# EAGLE design SideSolarPanel (EAGLE 6.6.0)
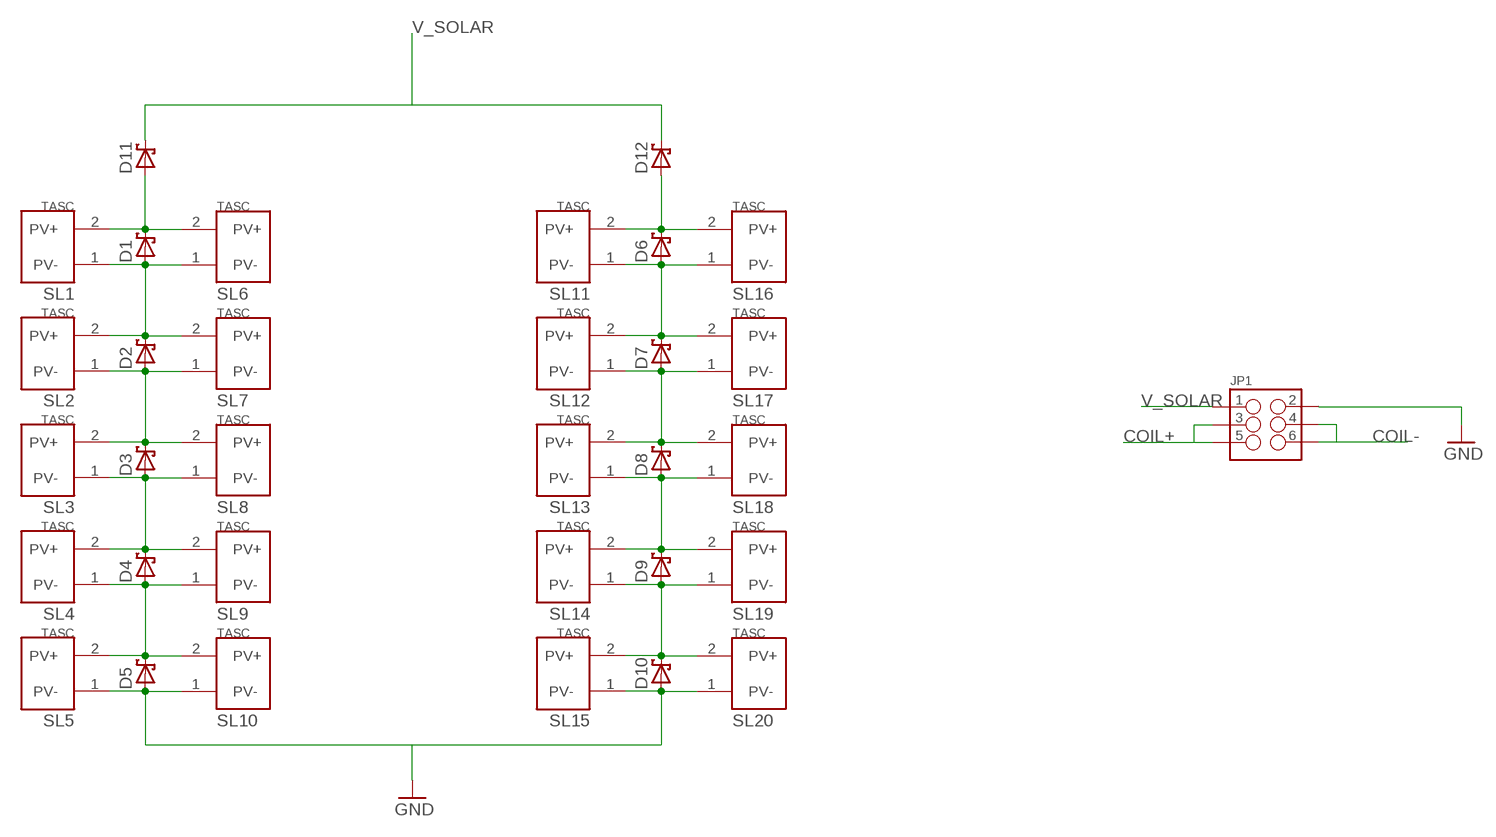
[diagram p0: schematic, sheet 1]

## Parts
D1  SB_DIODE  [SB_DIODE]
D2  SB_DIODE  [SB_DIODE]
D3  SB_DIODE  [SB_DIODE]
D4  SB_DIODE  [SB_DIODE]
D5  SB_DIODE  [SB_DIODE]
D6  SB_DIODE  [SB_DIODE]
D7  SB_DIODE  [SB_DIODE]
D8  SB_DIODE  [SB_DIODE]
D9  SB_DIODE  [SB_DIODE]
D10  SB_DIODE  [SB_DIODE]
D11  SB_DIODE  [SB_DIODE]
D12  SB_DIODE  [SB_DIODE]
JP1  M03X22X3_SILK_SM  [2X3]
SL1  SOLAR_CELL  [SOLAR_CELL]
SL2  SOLAR_CELL  [SOLAR_CELL]
SL3  SOLAR_CELL  [SOLAR_CELL]
SL4  SOLAR_CELL  [SOLAR_CELL]
SL5  SOLAR_CELL  [SOLAR_CELL]
SL6  SOLAR_CELL  [SOLAR_CELL]
SL7  SOLAR_CELL  [SOLAR_CELL]
SL8  SOLAR_CELL  [SOLAR_CELL]
SL9  SOLAR_CELL  [SOLAR_CELL]
SL10  SOLAR_CELL  [SOLAR_CELL]
SL11  SOLAR_CELL  [SOLAR_CELL]
SL12  SOLAR_CELL  [SOLAR_CELL]
SL13  SOLAR_CELL  [SOLAR_CELL]
SL14  SOLAR_CELL  [SOLAR_CELL]
SL15  SOLAR_CELL  [SOLAR_CELL]
SL16  SOLAR_CELL  [SOLAR_CELL]
SL17  SOLAR_CELL  [SOLAR_CELL]
SL18  SOLAR_CELL  [SOLAR_CELL]
SL19  SOLAR_CELL  [SOLAR_CELL]
SL20  SOLAR_CELL  [SOLAR_CELL]

## Nets
COIL+: JP1.3 JP1.5
COIL-: JP1.4
GND: D5.POS D10.POS JP1.2 SL5.1(PV-) SL10.1(PV-) SL15.1(PV-) SL20.1(PV-)
N$1: D6.POS D7.NEG SL11.1(PV-) SL12.2(PV+) SL16.1(PV-) SL17.2(PV+)
N$5: D6.NEG D12.POS SL11.2(PV+) SL16.2(PV+)
N$7: D7.POS D8.NEG SL12.1(PV-) SL13.2(PV+) SL17.1(PV-) SL18.2(PV+)
N$9: D1.NEG D11.POS SL1.2(PV+) SL6.2(PV+)
N$36: D8.POS D9.NEG SL13.1(PV-) SL14.2(PV+) SL18.1(PV-) SL19.2(PV+)
N$37: D2.POS D3.NEG SL2.1(PV-) SL3.2(PV+) SL7.1(PV-) SL8.2(PV+)
N$39: D3.POS D4.NEG SL3.1(PV-) SL4.2(PV+) SL8.1(PV-) SL9.2(PV+)
N$41: D9.POS D10.NEG SL14.1(PV-) SL15.2(PV+) SL19.1(PV-) SL20.2(PV+)
N$45: D1.POS D2.NEG SL1.1(PV-) SL2.2(PV+) SL6.1(PV-) SL7.2(PV+)
N$50: D4.POS D5.NEG SL4.1(PV-) SL5.2(PV+) SL9.1(PV-) SL10.2(PV+)
V_SOLAR: D11.NEG D12.NEG
Unconnected: JP1.1 JP1.6

## Library data of the parts
D1-D12 = phonesat:SB_DIODE
JP1 = SparkFun-Connectors:M03X2: 2x3 .1" header. Shrouded, with keying- CONN-10681 SMT- CONN-11415 Pogo pins- HW-11044
SL1-SL20 = phonesat:SOLAR_CELL

## Board
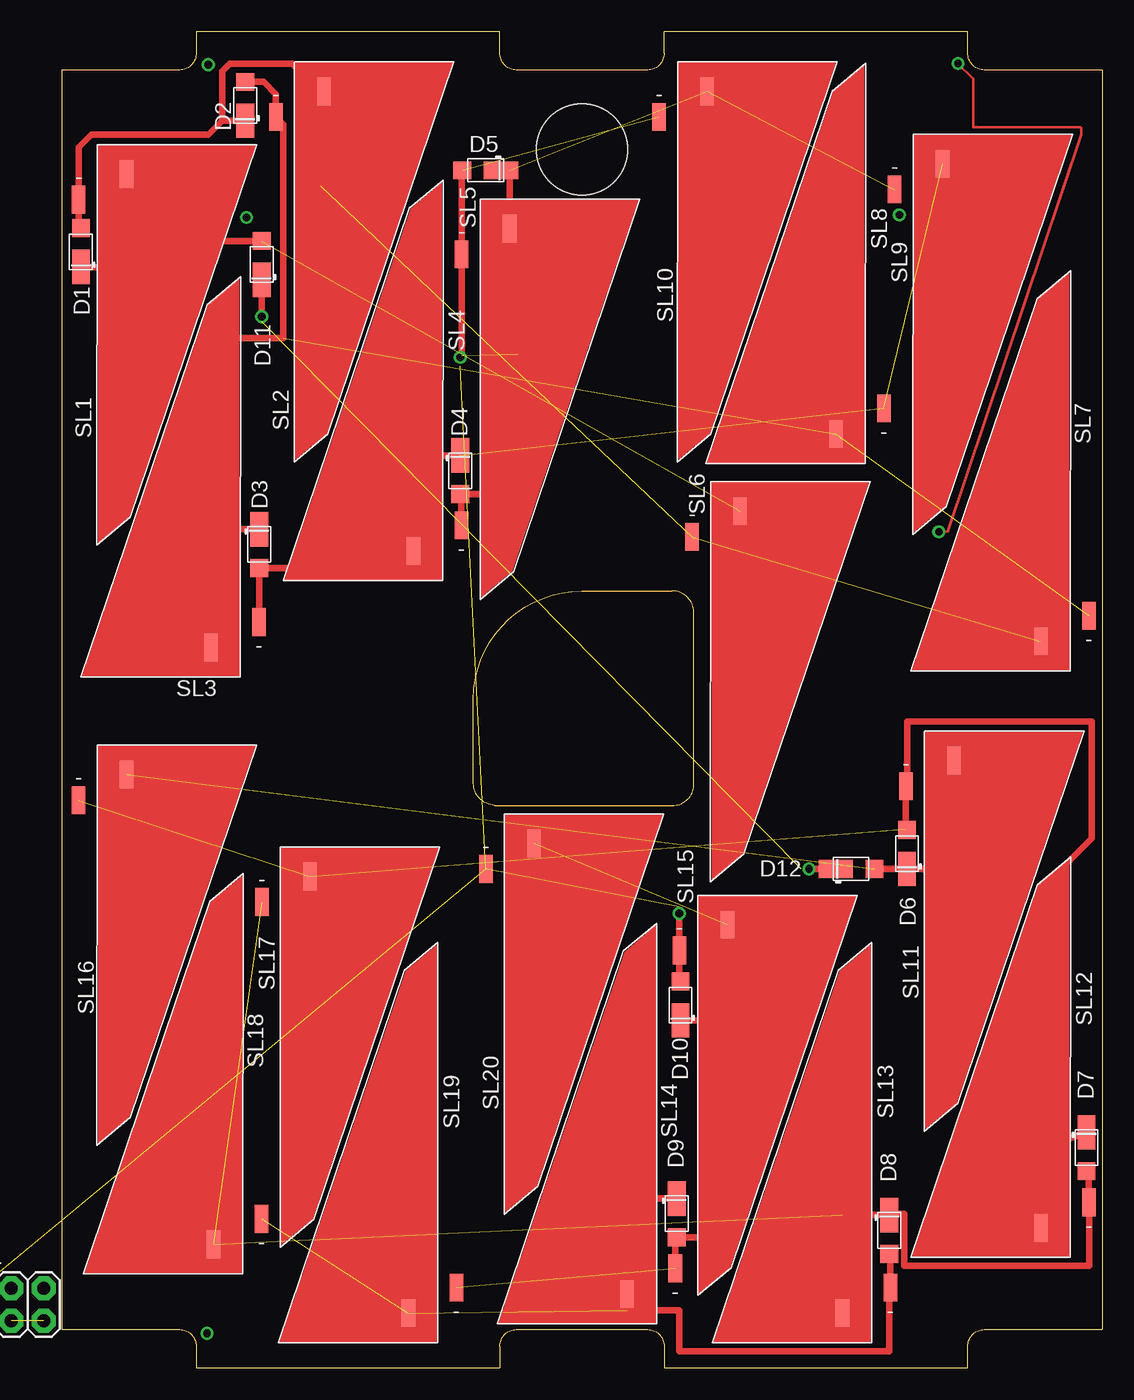
[diagram p1: board, top side]
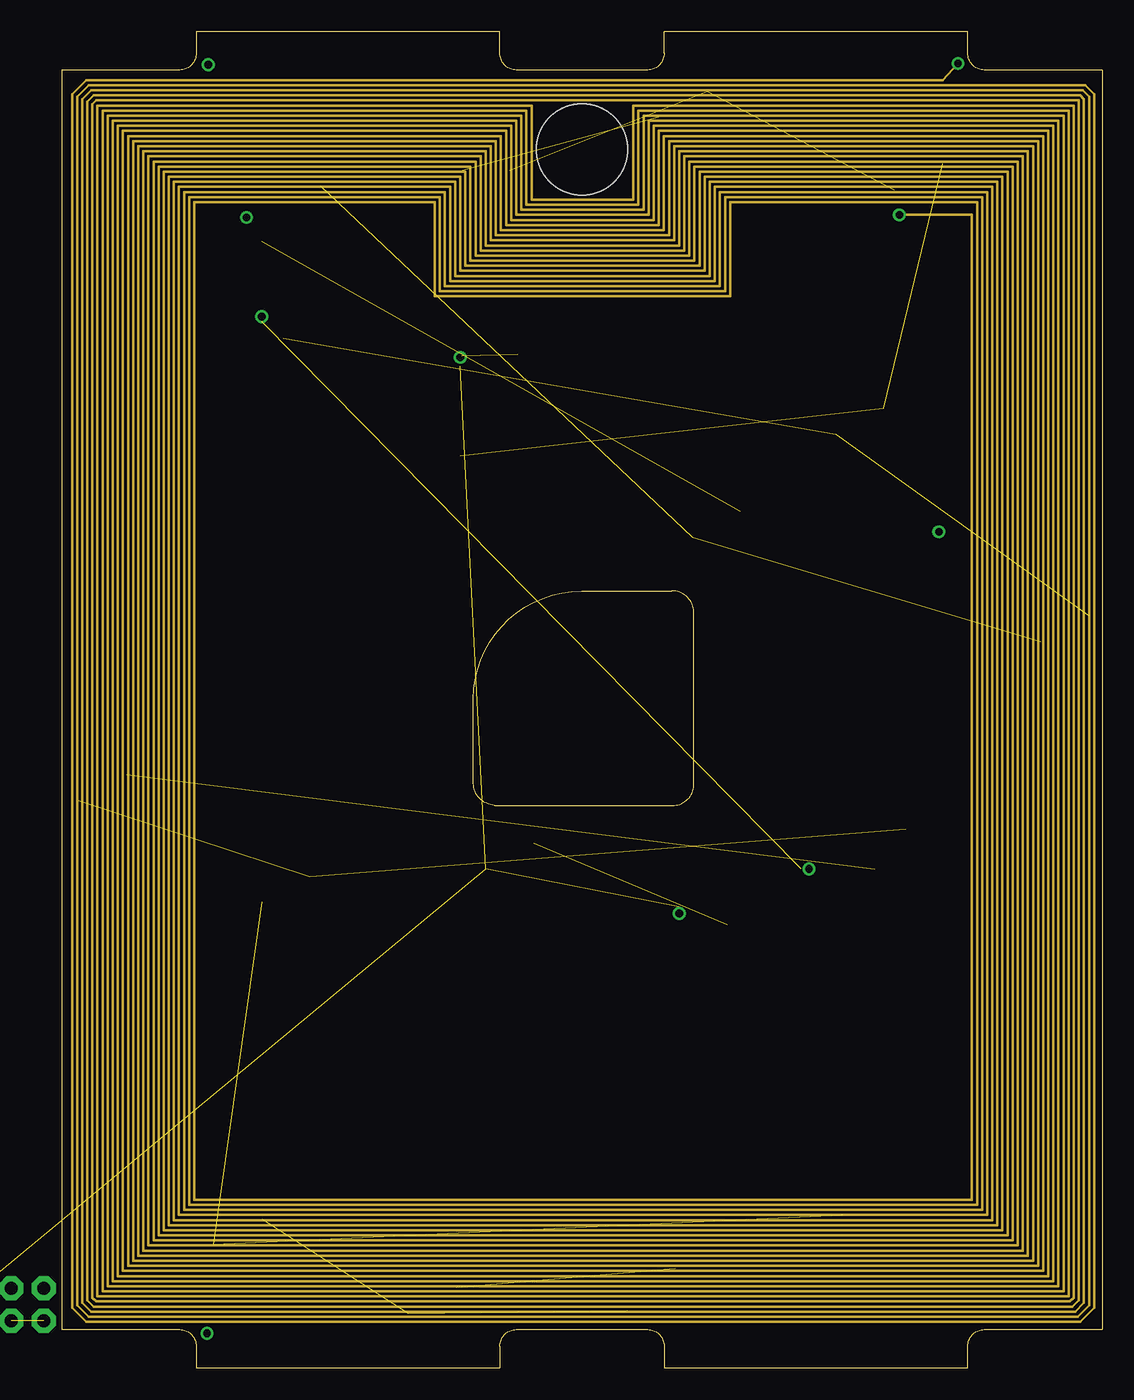
[diagram p2: board, inner layer Coil1]
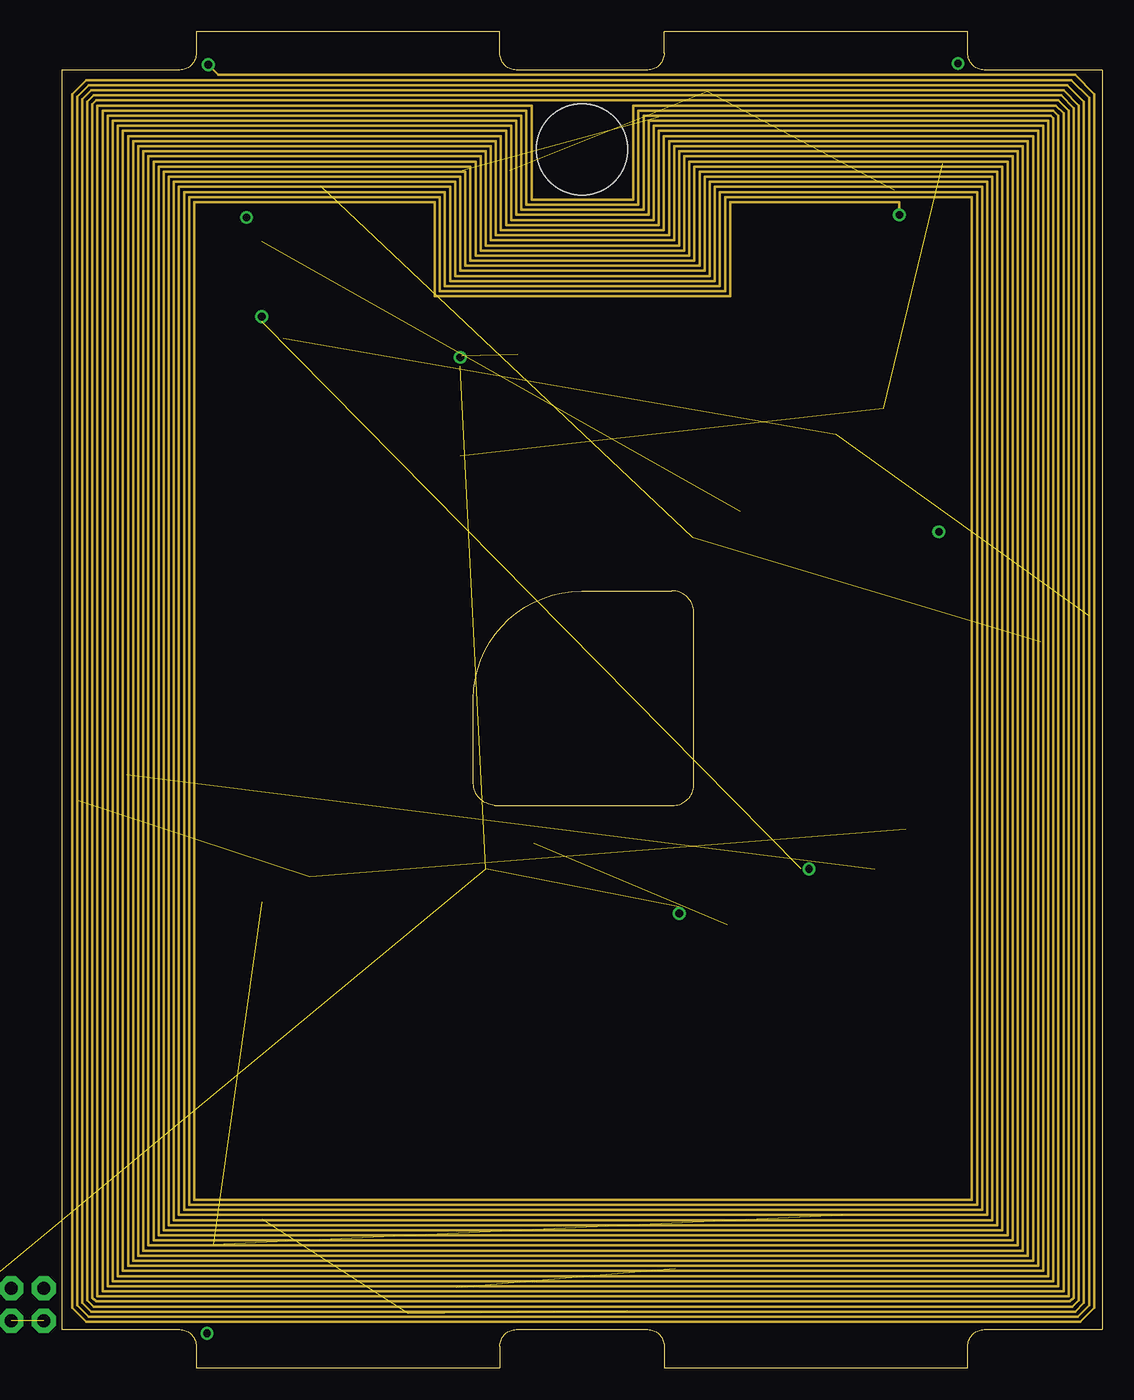
[diagram p3: board, inner layer Coil2]
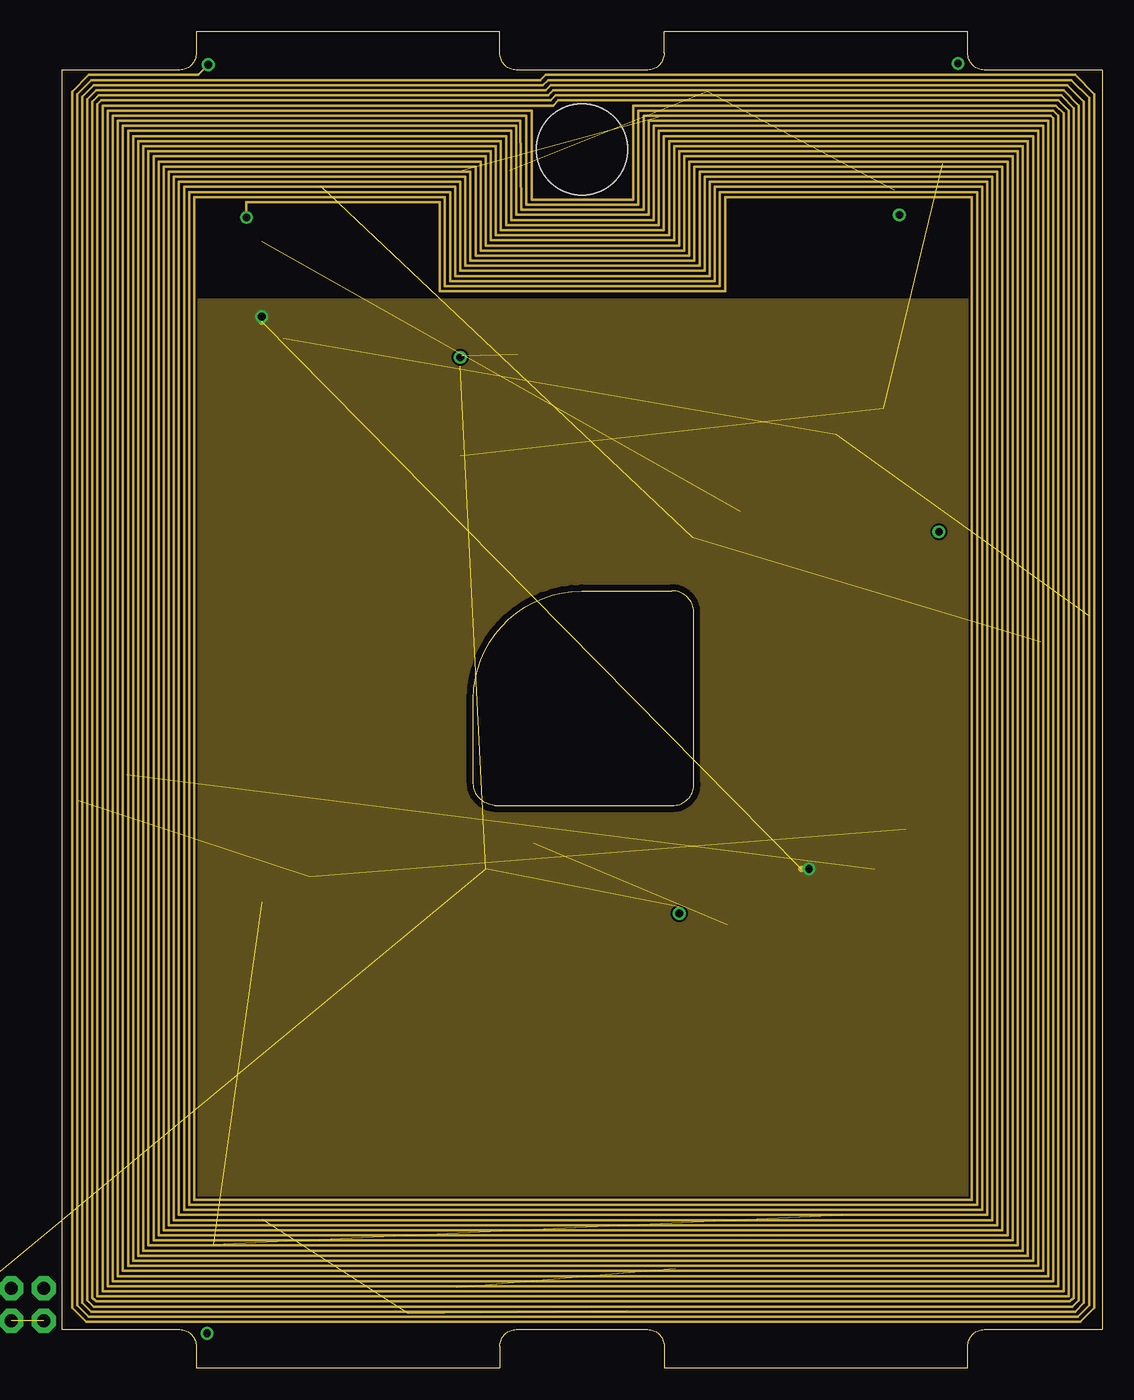
[diagram p4: board, inner layer Coil3]
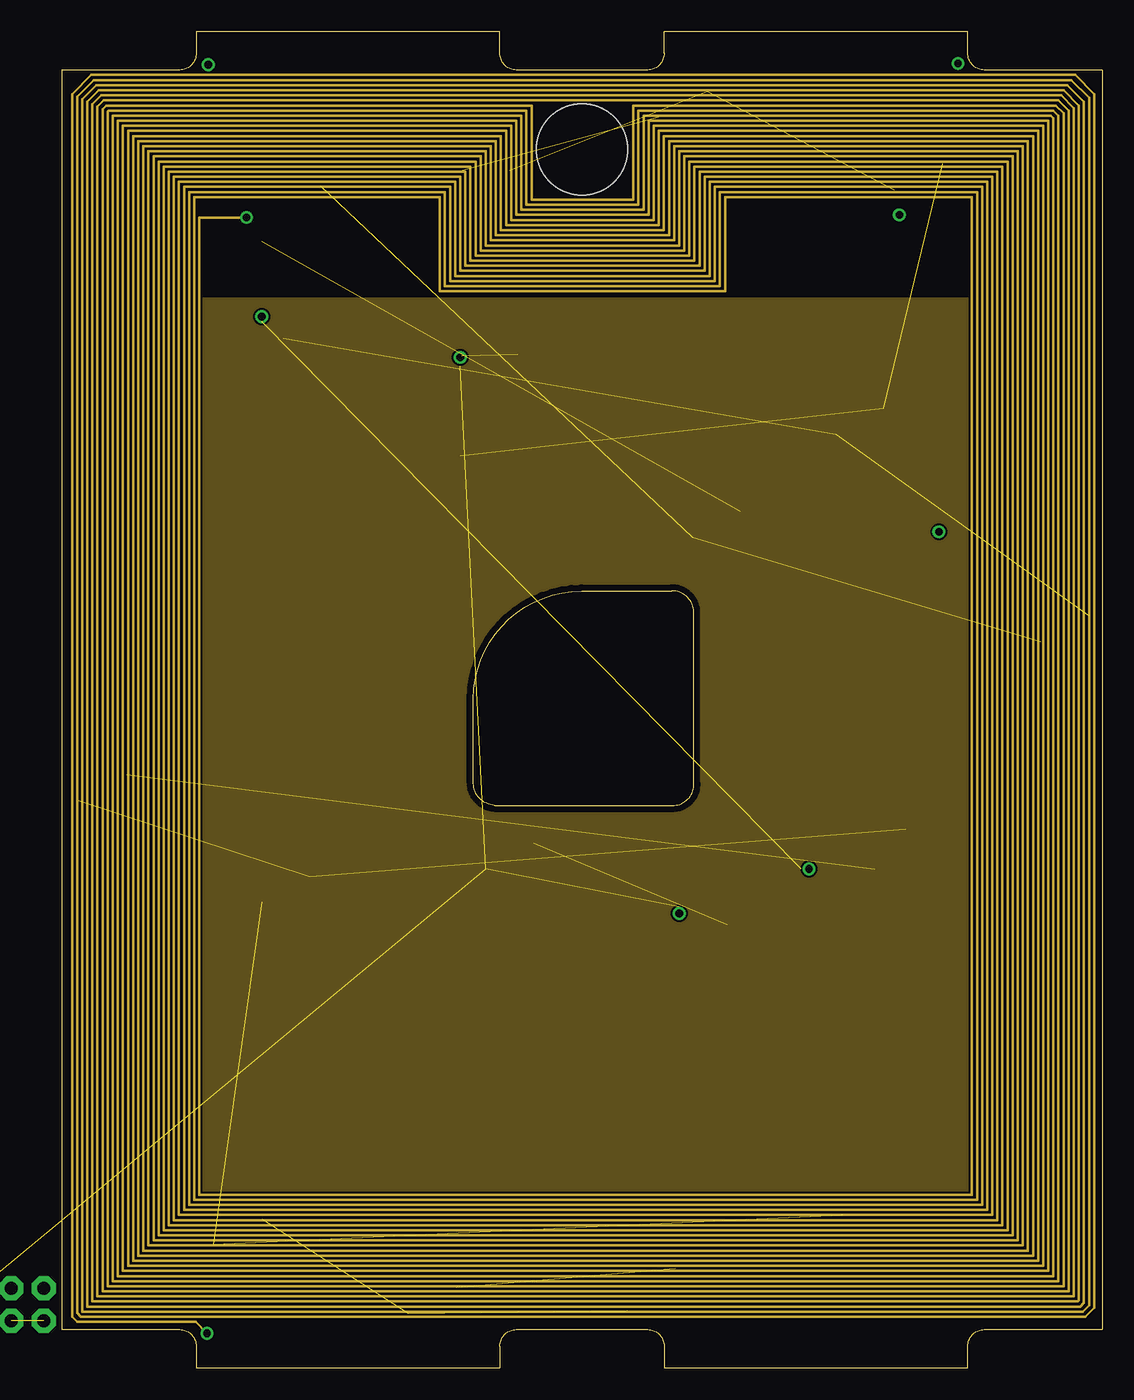
[diagram p5: board, inner layer Coil4]
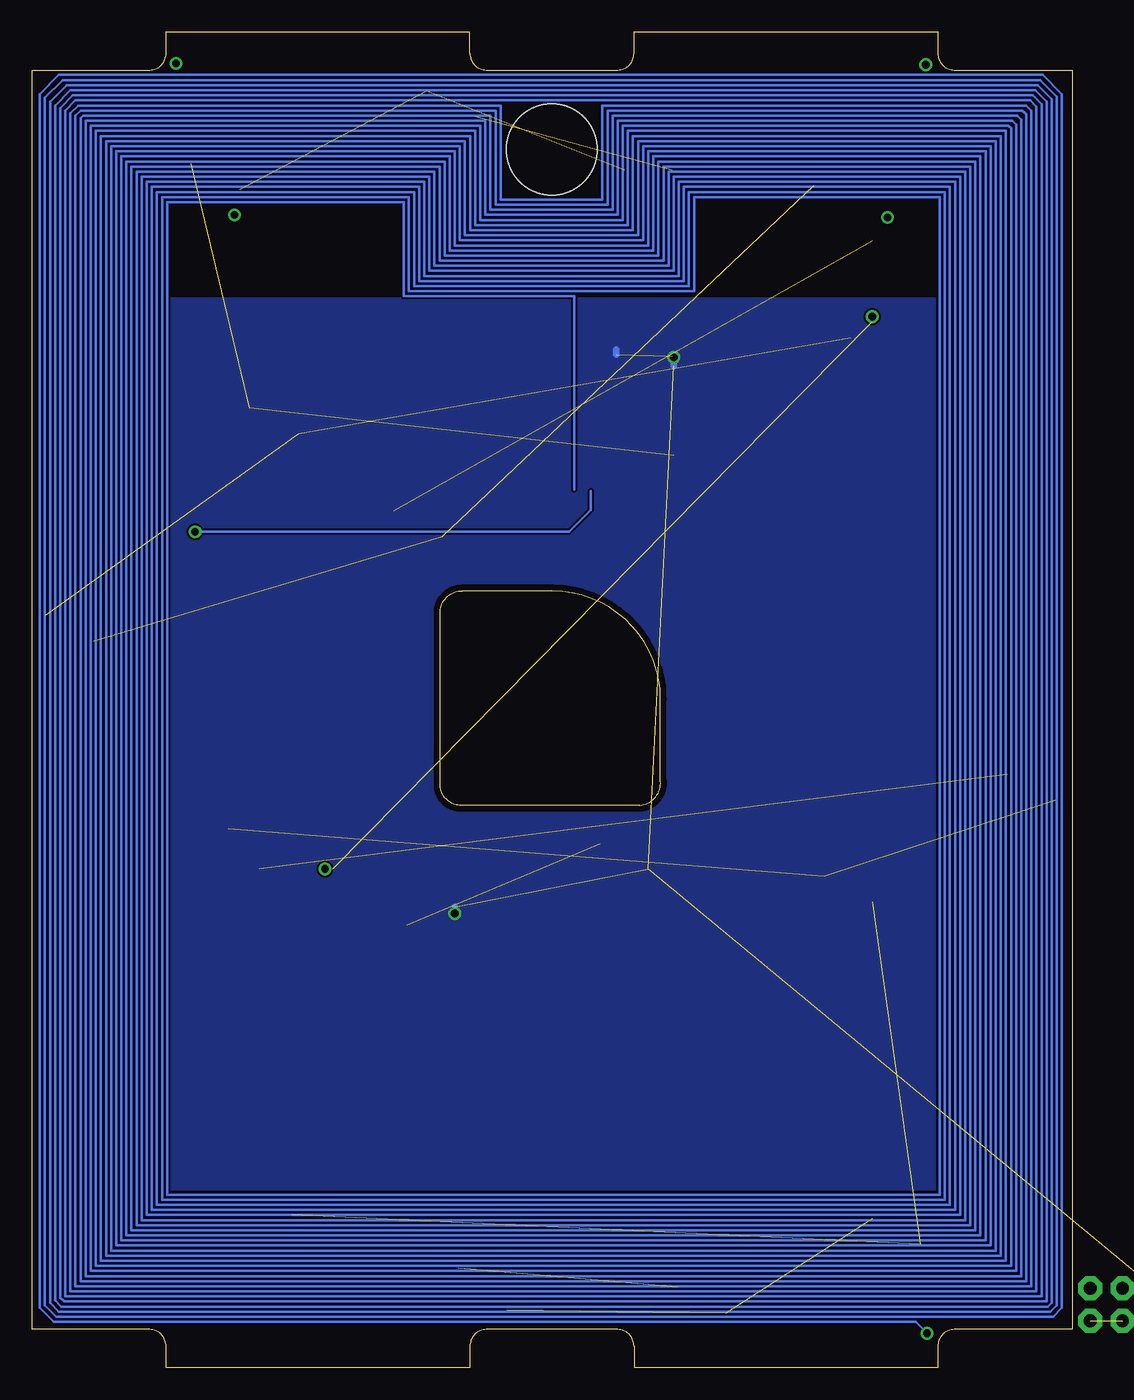
[diagram p6: board, bottom side, seen from below]

Size 81.73 x 104.99 mm. Coordinates in mm from the lower left corner, seen from the top.
Outline: 81.73,101.99 81.73,3 72.48,3 arc90 71.18,1.7 71.18,0 47.31,0 47.31,1.7 arc90 46.02,3 35.72,3 arc90 34.41,1.7 34.41,0 10.55,0 10.55,1.7 arc90 9.25,3 0,3 0,101.99 9.25,101.99 arc90 10.55,103.29 10.55,104.99 34.41,104.99 34.41,103.29 arc90 35.72,101.99 46.02,101.99 arc90 47.31,103.29 47.31,104.99 71.18,104.99 71.18,103.29 arc90 72.48,101.99 81.73,101.99
Outline: 32.34,52.54 arc-90 40.84,61.04 47.91,61.04 arc-90 49.64,59.42 49.65,45.91 arc-90 48.1,44.2 33.96,44.2 arc-90 32.34,46.08 32.34,52.54
Copper layers (1+2*3+14*15+16): Top 0.0178mm / dielectric 8mil / Coil1 0.0356mm / dielectric 14mil / Coil2 0.0356mm / dielectric 10mil / Coil3 0.0356mm / dielectric 14mil / Coil4 0.0356mm / dielectric 8mil / Bottom 0.0178mm
Design rules "SSC-EAGLE-6Lyr_v1.0.0.3": minimum track width 6mil, minimum drill 8mil, track to track 6mil, track to pad 6mil, pad to pad 6mil, via to via 6mil, smd to smd 6mil, copper to edge 20mil, drill to drill 16mil, minimum pad ring 8mil, minimum via ring 8mil, stop-mask expansion 3mil, vias tented up to drill 0mil, thermal gap 10mil
Holes 7.14 mm at 40.87,95.74

### Footprints (pad centres in the part's own frame; a part is rotated, then mirrored left to right if it is on the bottom)
SB_DIODE = smd 2.7 x 1.4: NEG -1.2,0 | smd 1.4 x 1.4: POS 1.85,0
2X3 = drill 1.016 pad 1.88 octagon: 1 0,0; 2 0,2.54; 3 2.54,0; 4 2.54,2.54; 5 5.08,0; 6 5.08,2.54
SOLAR_CELL = smd 1.067 x 2.184: 1 -1.589,2.999; 2 2.187,5.011

### Placement (x,y rotation side)
D1  1.5,87.7 90 top
D2  14.4,99.2 90 top
D3  15.5,64.7 270 top
D4  31.3,70.5 270 top
D5  33.3,94.1 180 top
D6  66.4,40.4 90 top
D7  80.5,17.3 270 top
D8  65,10.8 270 top
D9  48.3,12.1 270 top
D10  48.6,28.5 90 top
D11  15.7,86.7 90 top
D12  62,39.2 0 top
JP1  -6.5,3.7 0 top
SL1  2.9,88.8 0 top
SL2  18.4,95.3 0 top
SL3  13.9,61.6 180 top
SL4  29.8,69.2 180 top
SL5  33,84.5 0 top
SL6  51.1,62.3 0 top
SL7  79.1,62.1 180 top
SL8  63,78.4 180 top
SL9  67,89.6 0 top
SL10  48.5,95.3 0 top
SL11  67.9,42.7 0 top
SL12  79.1,16 180 top
SL13  63.5,9.3 180 top
SL14  46.6,10.8 180 top
SL15  50.1,29.8 0 top
SL16  2.9,41.6 0 top
SL17  17.3,33.6 0 top
SL18  14.1,14.7 180 top
SL19  29.4,9.3 180 top
SL20  34.9,36.2 0 top

### Tracks (layer width: path | path; a pad name or v marks a point on that pad's centre or on a via)
COIL  (via drill 0.6)
  Top 0.2: v68.9,65.7 69.6,65.7 80.1,96.9 80.1,97.4 80,97.5 71.6,97.5 71.6,101.3 v70.4,102.5
  Coil1 0.2: v65.8,90.6 71.5,90.6 71.5,13.2 10.4,13.2 10.4,91.6 29.3,91.6 29.3,84.2 52.5,84.2 52.5,91.6 71.9,91.6 71.9,12.8 10,12.8 10,92 29.7,92 29.7,84.6 52.1,84.6 52.1,92 72.3,92 72.3,12.4 9.6,12.4 9.6,92.4 30.1,92.4 30.1,85 51.7,85 51.7,92.4 72.7,92.4 72.7,12 9.2,12 9.2,92.8 30.5,92.8 30.5,85.4 51.3,85.4 51.3,92.8 73.1,92.8 73.1,11.6 8.8,11.6 8.8,93.2 30.9,93.2 30.9,85.8 50.9,85.8 50.9,93.2 73.5,93.2 73.5,11.2 8.4,11.2 8.4,93.6 31.3,93.6 31.3,86.2 50.5,86.2 50.5,93.6 73.9,93.6 73.9,10.8 8,10.8 8,94 31.7,94 31.7,86.6 50.1,86.6 50.1,94 74.3,94 74.3,10.4 7.6,10.4 7.6,94.4 32.1,94.4 32.1,87 49.7,87 49.7,94.4 74.7,94.4 74.7,10 7.2,10 7.2,94.8 32.5,94.8 32.5,87.4 49.3,87.4 49.3,94.8 75.1,94.8 75.1,9.6 6.8,9.6 6.8,95.2 32.9,95.2 32.9,87.8 48.9,87.8 48.9,95.2 75.5,95.2 75.5,9.2 6.4,9.2 6.4,95.6 33.3,95.6 33.3,88.2 48.5,88.2 48.5,95.6 75.9,95.6 75.9,8.8 6,8.8 6,96 33.7,96 33.7,88.6 48.1,88.6 48.1,96 76.3,96 76.3,8.4 5.6,8.4 5.6,96.4 34.1,96.4 34.1,89 47.7,89 47.7,96.4 76.7,96.4 76.7,8 5.2,8 5.2,96.8 34.5,96.8 34.5,89.4 47.3,89.4 47.3,96.8 77.1,96.8 77.1,7.6 4.8,7.6 4.8,97.2 34.9,97.2 34.9,89.8 46.9,89.8 46.9,97.2 77.5,97.2 77.5,7.2 4.4,7.2 4.4,97.6 35.3,97.6 35.3,90.2 46.5,90.2 46.5,97.6 77.9,97.6 77.9,6.8 4,6.8 4,98 35.7,98 35.7,90.6 46.1,90.6 46.1,98 78.3,98 78.3,6.4 3.6,6.4 3.6,98.4 36.1,98.4 36.1,91 45.7,91 45.7,98.4 78.7,98.4 78.7,6 3.2,6 3.2,98.8 36.5,98.8 36.5,91.4 45.3,91.4 45.3,98.8 79.1,98.8 79.1,5.6 2.8,5.6 2.8,99.2 36.9,99.2 36.9,91.8 44.9,91.8 44.9,99.2 79.5,99.2 79.5,5.5 79.2,5.2 2.7,5.2 2.4,5.5 2.4,99.3 2.7,99.6 79.9,99.6 79.9,5.3 79.4,4.8 2.5,4.8 2,5.3 2,99.5 2.5,100 80,100 80.3,99.7 80.3,5.1 79.6,4.4 2.3,4.4 1.6,5.1 1.6,99.7 2.3,100.4 80.2,100.4 80.7,99.9 80.7,4.9 79.8,4 2.1,4 1.2,4.9 1.2,99.9 2.1,100.8 80.4,100.8 81.1,100.1 81.1,4.7 80,3.6 1.9,3.6 0.8,4.7 0.8,100.1 1.9,101.2 69.2,101.2 v70.4,102.5
  Coil2 0.2: v65.8,90.6 65.8,91.6 52.5,91.6 52.5,84.2 29.3,84.2 29.3,91.6 10.4,91.6 10.4,13.2 71.5,13.2 71.5,92 52.1,92 52.1,84.6 29.7,84.6 29.7,92 10,92 10,12.8 71.9,12.8 71.9,92.4 51.7,92.4 51.7,85 30.1,85 30.1,92.4 9.6,92.4 9.6,12.4 72.3,12.4 72.3,92.8 51.3,92.8 51.3,85.4 30.5,85.4 30.5,92.8 9.2,92.8 9.2,12 72.7,12 72.7,93.2 50.9,93.2 50.9,85.8 30.9,85.8 30.9,93.2 8.8,93.2 8.8,11.6 73.1,11.6 73.1,93.6 50.5,93.6 50.5,86.2 31.3,86.2 31.3,93.6 8.4,93.6 8.4,11.2 73.5,11.2 73.5,94 50.1,94 50.1,86.6 31.7,86.6 31.7,94 8,94 8,10.8 73.9,10.8 73.9,94.4 49.7,94.4 49.7,87 32.1,87 32.1,94.4 7.6,94.4 7.6,10.4 74.3,10.4 74.3,94.8 49.3,94.8 49.3,87.4 32.5,87.4 32.5,94.8 7.2,94.8 7.2,10 74.7,10 74.7,95.2 48.9,95.2 48.9,87.8 32.9,87.8 32.9,95.2 6.8,95.2 6.8,9.6 75.1,9.6 75.1,95.6 48.5,95.6 48.5,88.2 33.3,88.2 33.3,95.6 6.4,95.6 6.4,9.2 75.5,9.2 75.5,96 48.1,96 48.1,88.6 33.7,88.6 33.7,96 6,96 6,8.8 75.9,8.8 75.9,96.4 47.7,96.4 47.7,89 34.1,89 34.1,96.4 5.6,96.4 5.6,8.4 76.3,8.4 76.3,96.8 47.3,96.8 47.3,89.4 34.5,89.4 34.5,96.8 5.2,96.8 5.2,8 76.7,8 76.7,97.2 46.9,97.2 46.9,89.8 34.9,89.8 34.9,97.2 4.8,97.2 4.8,7.6 77.1,7.6 77.1,97.6 46.5,97.6 46.5,90.2 35.3,90.2 35.3,97.6 4.4,97.6 4.4,7.2 77.5,7.2 77.5,98 46.1,98 46.1,90.6 35.7,90.6 35.7,98 4,98 4,6.8 77.9,6.8 77.9,98.2 77.7,98.4 45.7,98.4 45.7,91 36.1,91 36.1,98.4 3.6,98.4 3.6,6.4 78.3,6.4 78.3,98.4 77.9,98.8 45.3,98.8 45.3,91.4 36.5,91.4 36.5,98.8 3.2,98.8 3.2,6 78.7,6 78.7,98.6 78.1,99.2 44.9,99.2 44.9,91.8 36.9,91.8 36.9,99.2 2.8,99.2 2.8,5.6 79.1,5.6 79.1,98.8 78.3,99.6 2.7,99.6 2.4,99.3 2.4,5.5 2.7,5.2 79.2,5.2 79.5,5.5 79.5,99 78.5,100 2.5,100 2,99.5 2,5.3 2.5,4.8 79.4,4.8 79.9,5.3 79.9,99.2 78.7,100.4 2.3,100.4 1.6,99.7 1.6,5.1 2.3,4.4 79.6,4.4 80.3,5.1 80.3,99.5 79,100.8 2.1,100.8 1.2,99.9 1.2,4.9 2.1,4 79.8,4 80.7,4.9 80.7,99.8 79.3,101.2 1.9,101.2 0.8,100.1 0.8,4.7 1.9,3.6 80,3.6 81.1,4.7 81.1,100.1 79.6,101.6 12.3,101.6 v11.5,102.4
  Coil3 0.2: v14.5,90.4 14.5,91.6 29.7,91.6 29.7,84.6 52.1,84.6 52.1,92 71.5,92 71.5,13.2 10.4,13.2 10.4,92 30.1,92 30.1,85 51.7,85 51.7,92.4 71.9,92.4 71.9,12.8 10,12.8 10,92.4 30.5,92.4 30.5,85.4 51.3,85.4 51.3,92.8 72.3,92.8 72.3,12.4 9.6,12.4 9.6,92.8 30.9,92.8 30.9,85.8 50.9,85.8 50.9,93.2 72.7,93.2 72.7,12 9.2,12 9.2,93.2 31.3,93.2 31.3,86.2 50.5,86.2 50.5,93.6 73.1,93.6 73.1,11.6 8.8,11.6 8.8,93.6 31.7,93.6 31.7,86.6 50.1,86.6 50.1,94 73.5,94 73.5,11.2 8.4,11.2 8.4,94 32.1,94 32.1,87 49.7,87 49.7,94.4 73.9,94.4 73.9,10.8 8,10.8 8,94.4 32.5,94.4 32.5,87.4 49.3,87.4 49.3,94.8 74.3,94.8 74.3,10.4 7.6,10.4 7.6,94.8 32.9,94.8 32.9,87.8 48.9,87.8 48.9,95.2 74.7,95.2 74.7,10 7.2,10 7.2,95.2 33.3,95.2 33.3,88.2 48.5,88.2 48.5,95.6 75.1,95.6 75.1,9.6 6.8,9.6 6.8,95.6 33.7,95.6 33.7,88.6 48.1,88.6 48.1,96 75.5,96 75.5,9.2 6.4,9.2 6.4,96 34.1,96 34.1,89 47.7,89 47.7,96.4 75.9,96.4 75.9,8.8 6,8.8 6,96.4 34.5,96.4 34.5,89.4 47.3,89.4 47.3,96.8 76.3,96.8 76.3,8.4 5.6,8.4 5.6,96.8 34.9,96.8 34.9,89.8 46.9,89.8 46.9,97.2 76.7,97.2 76.7,8 5.2,8 5.2,97.2 35.3,97.2 35.3,90.2 46.5,90.2 46.5,97.6 77.1,97.6 77.1,7.6 4.8,7.6 4.8,97.6 35.7,97.6 35.7,90.6 46.1,90.6 46.1,98 77.5,98 77.5,7.2 4.4,7.2 4.4,98 36,98 36.1,91 45.7,91 45.7,98.4 77.7,98.4 77.9,98.2 77.9,6.8 4,6.8 4,98.4 36.5,98.4 36.5,91.4 45.3,91.4 45.3,98.8 77.9,98.8 78.3,98.4 78.3,6.4 3.6,6.4 3.6,98.8 36.9,98.8 36.9,91.8 44.9,91.8 44.9,99.2 78.1,99.2 78.7,98.6 78.7,6 3.2,6 3.2,99.2 38.6,99.2 39,99.6 78.3,99.6 79.1,98.8 79.1,5.6 2.8,5.6 2.8,99.3 3.1,99.6 38.4,99.6 38.8,100 78.5,100 79.5,99 79.5,5.5 79.2,5.2 2.7,5.2 2.4,5.5 2.4,99.5 2.9,100 38.2,100 38.6,100.4 78.7,100.4 79.9,99.2 79.9,5.3 79.4,4.8 2.5,4.8 2,5.3 2,99.7 2.7,100.4 38,100.4 38.4,100.8 79,100.8 80.3,99.5 80.3,5.1 79.6,4.4 2.3,4.4 1.6,5.1 1.6,99.9 2.5,100.8 37.8,100.8 38.2,101.2 79.3,101.2 80.7,99.8 80.7,4.9 79.8,4 2.1,4 1.2,4.9 1.2,100.1 2.3,101.2 37.6,101.2 38,101.6 79.6,101.6 81.1,100.1 81.1,4.7 80,3.6 1.9,3.6 0.8,4.7 0.8,100.3 2.1,101.6 10.7,101.6 v11.5,102.4
  Coil4 0.2: v14.5,90.4 10.8,90.4 10.8,13.6 71.5,13.6 71.5,92 52.1,92 52.1,84.6 29.7,84.6 29.7,92 10.4,92 10.4,13.2 71.9,13.2 71.9,92.4 51.7,92.4 51.7,85 30.1,85 30.1,92.4 10,92.4 10,12.8 72.3,12.8 72.3,92.8 51.3,92.8 51.3,85.4 30.5,85.4 30.5,92.8 9.6,92.8 9.6,12.4 72.7,12.4 72.7,93.2 50.9,93.2 50.9,85.8 30.9,85.8 30.9,93.2 9.2,93.2 9.2,12 73.1,12 73.1,93.6 50.5,93.6 50.5,86.2 31.3,86.2 31.3,93.6 8.8,93.6 8.8,11.6 73.5,11.6 73.5,94 50.1,94 50.1,86.6 31.7,86.6 31.7,94 8.4,94 8.4,11.2 73.9,11.2 73.9,94.4 49.7,94.4 49.7,87 32.1,87 32.1,94.4 8,94.4 8,10.8 74.3,10.8 74.3,94.8 49.3,94.8 49.3,87.4 32.5,87.4 32.5,94.8 7.6,94.8 7.6,10.4 74.7,10.4 74.7,95.2 48.9,95.2 48.9,87.8 32.9,87.8 32.9,95.2 7.2,95.2 7.2,10 75.1,10 75.1,95.6 48.5,95.6 48.5,88.2 33.3,88.2 33.3,95.6 6.8,95.6 6.8,9.6 75.5,9.6 75.5,96 48.1,96 48.1,88.6 33.7,88.6 33.7,96 6.4,96 6.4,9.2 75.9,9.2 75.9,96.4 47.7,96.4 47.7,89 34.1,89 34.1,96.4 6,96.4 6,8.8 76.3,8.8 76.3,96.8 47.3,96.8 47.3,89.4 34.5,89.4 34.5,96.8 5.6,96.8 5.6,8.4 76.7,8.4 76.7,97.2 46.9,97.2 46.9,89.8 34.9,89.8 34.9,97.2 5.2,97.2 5.2,8 77.1,8 77.1,97.6 46.5,97.6 46.5,90.2 35.3,90.2 35.3,97.6 4.8,97.6 4.8,7.6 77.5,7.6 77.5,98 46.1,98 46.1,90.6 35.7,90.6 35.7,98 4.4,98 4.4,7.2 77.9,7.2 77.9,98.2 77.7,98.4 45.7,98.4 45.7,91 36.1,91 36.1,98.4 4,98.4 4,6.8 78.3,6.8 78.3,98.4 77.9,98.8 45.3,98.8 45.3,91.4 36.5,91.4 36.5,98.8 3.7,98.8 3.6,98.7 3.6,6.4 78.7,6.4 78.7,98.6 78.1,99.2 44.9,99.2 44.9,91.8 36.9,91.8 36.9,99.2 3.5,99.2 3.2,98.9 3.2,6 79.1,6 79.1,98.8 78.3,99.6 3.3,99.6 2.8,99.1 2.8,5.6 79.5,5.6 79.5,99 78.5,100 3.1,100 2.4,99.3 2.4,5.2 79.8,5.2 79.9,5.3 79.9,99.2 78.7,100.4 2.9,100.4 2,99.5 2,4.8 80,4.8 80.3,5.1 80.3,99.5 79,100.8 2.7,100.8 1.6,99.7 1.6,4.4 80.2,4.4 80.7,4.9 80.7,99.8 79.3,101.2 2.5,101.2 1.2,99.9 1.2,4.3 1.5,4 80.4,4 81.1,4.7 81.1,100.1 79.6,101.6 2.3,101.6 0.8,100.1 0.8,4 1.2,3.6 10.5,3.6 v11.4,2.7
  Bottom 0.2: v68.9,65.7 39.5,65.7 37.8,67.4 37.8,68.9 | v11.4,2.7 12.3,3.6 80,3.6 81.1,4.7 81.1,100.1 79.6,101.6 2.3,101.6 0.8,100.1 0.8,4.7 1.5,4 79.8,4 80.7,4.9 80.7,99.8 79.3,101.2 2.5,101.2 1.2,99.9 1.2,4.9 1.7,4.4 79.6,4.4 80.3,5.1 80.3,99.5 79,100.8 2.7,100.8 1.6,99.7 1.6,5.1 1.9,4.8 79.4,4.8 79.9,5.3 79.9,99.2 78.7,100.4 2.9,100.4 2,99.5 2,5.2 79.2,5.2 79.5,5.5 79.5,99 78.5,100 3.1,100 2.4,99.3 2.4,5.6 79.1,5.6 79.1,98.8 78.3,99.6 3.3,99.6 2.8,99.1 2.8,6 78.7,6 78.7,98.6 78.1,99.2 44.9,99.2 44.9,91.8 36.9,91.8 36.9,99.2 3.6,99.2 3.2,98.8 3.2,6.4 78.3,6.4 78.3,98.4 77.9,98.8 45.3,98.8 45.3,91.4 36.5,91.4 36.5,98.8 3.9,98.8 3.6,98.5 3.6,6.8 77.9,6.8 77.9,98.2 77.7,98.4 45.7,98.4 45.7,91 36.1,91 36.1,98.4 4.3,98.4 4,98.1 4,7.2 77.5,7.2 77.5,98 46.1,98 46.1,90.6 35.7,90.6 35.7,98 4.7,98 4.4,97.7 4.4,7.6 77.1,7.6 77.1,97.6 46.5,97.6 46.5,90.2 35.3,90.2 35.3,97.6 5,97.6 4.8,97.4 4.8,8 76.7,8 76.7,97.2 46.9,97.2 46.9,89.8 34.9,89.8 34.9,97.2 5.2,97.2 5.2,8.4 76.3,8.4 76.3,96.8 47.3,96.8 47.3,89.4 34.5,89.4 34.5,96.8 5.6,96.8 5.6,8.8 75.9,8.8 75.9,96.4 47.7,96.4 47.7,89 34.1,89 34.1,96.4 6,96.4 6,9.2 75.5,9.2 75.5,96 48.1,96 48.1,88.6 33.7,88.6 33.7,96 6.4,96 6.4,9.6 75.1,9.6 75.1,95.6 48.5,95.6 48.5,88.2 33.3,88.2 33.3,95.6 6.8,95.6 6.8,10 74.7,10 74.7,95.2 48.9,95.2 48.9,87.8 32.9,87.8 32.9,95.2 7.2,95.2 7.2,10.4 74.3,10.4 74.3,94.8 49.3,94.8 49.3,87.4 32.5,87.4 32.5,94.8 7.6,94.8 7.6,10.8 73.9,10.8 73.9,94.4 49.7,94.4 49.7,87 32.1,87 32.1,94.4 8,94.4 8,11.2 73.5,11.2 73.5,94 50.1,94 50.1,86.6 31.7,86.6 31.7,94 8.4,94 8.4,11.6 73.1,11.6 73.1,93.6 50.5,93.6 50.5,86.2 31.3,86.2 31.3,93.6 8.8,93.6 8.8,12 72.7,12 72.7,93.2 50.9,93.2 50.9,85.8 30.9,85.8 30.9,93.2 9.2,93.2 9.2,12.4 72.3,12.4 72.3,92.8 51.3,92.8 51.3,85.4 30.5,85.4 30.5,92.8 9.6,92.8 9.6,12.8 71.9,12.8 71.9,92.4 51.7,92.4 51.7,85 30.1,85 30.1,92.4 10,92.4 10,13.2 71.5,13.2 71.5,92 52.1,92 52.1,84.6 29.7,84.6 29.7,92 10.4,92 10.4,13.6 71.1,13.6 71.1,91.6 52.5,91.6 52.5,84.2 39.1,84.2 39.1,69
COIL+  (1 unrouted)
GND  (via drill 0.6)  (5 unrouted)
  Top 0.5: D5.POS 31.41,94.06 SL5.1 31.41,79.51 v31.3,79.4 | D10.POS 48.51,30.44 SL15.1 v48.5,35.7
  Bottom 0.5: 35.8,80 35.8,79.6 | v31.3,79.4 31.3,78.7 | v48.5,35.7 48.5,36.2
  cutout Bottom: 32.7,46.5 32.7,45.5 33.4,44.6 48.2,44.5 49,44.8 49.4,45.8 49.4,59.6 49.1,60.5 48,60.8 40.2,60.8 38.1,60.3 35.9,59.1 34.1,57.3 32.9,55.1 32.7,53.4 32.7,52.2 32.7,46.4
  pour Bottom (no thermals): 71.2,84 10.8,84 10.8,14 71.1,14
N$1  (2 unrouted)
  Top 0.5: 66.51,42.26 D6.POS | D7.NEG 77.2,17.3 | 77.2,17.3 77.01,17.3 SL12.2 | 66.41,42.34 D6.POS | 77.2,17.3 78.2,18.3 78.2,38.9 80.9,41.6 80.9,50.8 66.4,50.8 66.4,45.9 SL11.1 66.31,42.34 D6.POS
N$5  (1 unrouted)
  Top 0.5: SL11.2 70.09,39.2 D6.NEG D12.POS
N$7  (2 unrouted)
  Top 0.5: SL13.2 61.31,12 D8.NEG 65,12.1 66.2,12.1 66.2,8 80.7,8 80.7,11.7 SL12.1 80.69,15.06 D7.POS
N$9  (1 unrouted)
  Top 0.5: D1.NEG 4.89,86.5 4.89,89 | 4.89,89 SL1.2 | D11.POS 5.34,88.55 4.89,89
N$17
  cutout Coil4: 34.1,44.4 48.1,44.4 49.2,45 49.5,45.8 49.4,59.6 48.9,60.5 48.3,60.8 40.3,60.8 37.3,60 34.6,58 32.9,55 32.6,53.1 32.6,45.6 33,44.9
N$18
  cutout Coil3: 34.1,44.4 48.2,44.4 49.1,44.9 49.5,45.6 49.5,59.5 49.1,60.4 48.2,60.8 40.7,60.8 38.1,60.4 36,59.2 34.7,58.2 33.4,56.2 32.7,54.2 32.6,53.3 32.6,45.8 32.9,44.9
N$36  (2 unrouted)
  Top 0.5: D8.POS 65.09,8.86 SL13.1 65,6.3 65,1.3 48.5,1.3 48.5,4.5 44.41,4.5 SL14.2 44.41,13.3 D9.NEG
N$37  (2 unrouted)
  Top 0.5: 13.3,59.98 12.06,58.74 | 12.06,58.74 SL3.2 | D3.NEG 12.7,65.9 | 12.7,65.9 12.06,65.9 12.06,58.74 | 12.7,65.9 12.7,80.9 17.4,80.9 17.4,97.71 SL2.1 16.8,100.1 15.85,101.05 D2.POS
N$39  (2 unrouted)
  Top 0.5: SL3.1 15.49,62.84 D3.POS 27.31,62.85 SL4.2 27.31,71.7 D4.NEG
N$41  (2 unrouted)
  Top 0.5: SL14.1 48.19,10.16 D9.POS 51.6,10.25 51.6,27.3 | D10.NEG 51.6,27.3 | 51.6,27.3 52.29,27.3 SL15.2
N$45  (2 unrouted)
  Top 0.5: D1.POS 1.31,89.94 SL1.1 1.31,95.91 2.3,96.9 11.5,96.9 12.6,98 | 20.29,92.9 SL2.2 19.6,101 18.1,102.5 13.2,102.5 12.6,101.9 12.6,98 | D2.NEG 12.6,98
N$50  (2 unrouted)
  Top 0.5: SL4.1 31.39,68.56 D4.POS 35.19,68.65 SL5.2 35.19,94.1 D5.NEG
V_SOLAR  (via drill 0.6)  (1 unrouted)
  Top 0.5: D12.NEG v58.7,39.2 | D11.NEG v15.7,82.6
  Coil3 0.5: v58.7,39.2 58.1,39.2 | v15.7,82.6 15.7,82.2
  pour Coil3: 10.5,13.3 71.3,13.3 71.3,84 10.5,84
VCC_5
  pour Coil4: 11,84.1 11,13.3 71.4,13.3 71.4,84.1